# Altium schematic sheet BlockDiagram.SchDoc
size A3; ApprovedBy: -; CheckedBy: -; Engineer: Nasıf Can PELTEK; Revision: 00; SheetNumber: 2; SheetTotal: 7; releaseDate: -; changeDate: -; Department: Embedded; Size: A3; projeDescription: Wirless Security Dedector; fileName: BlockDiagram.SchDoc
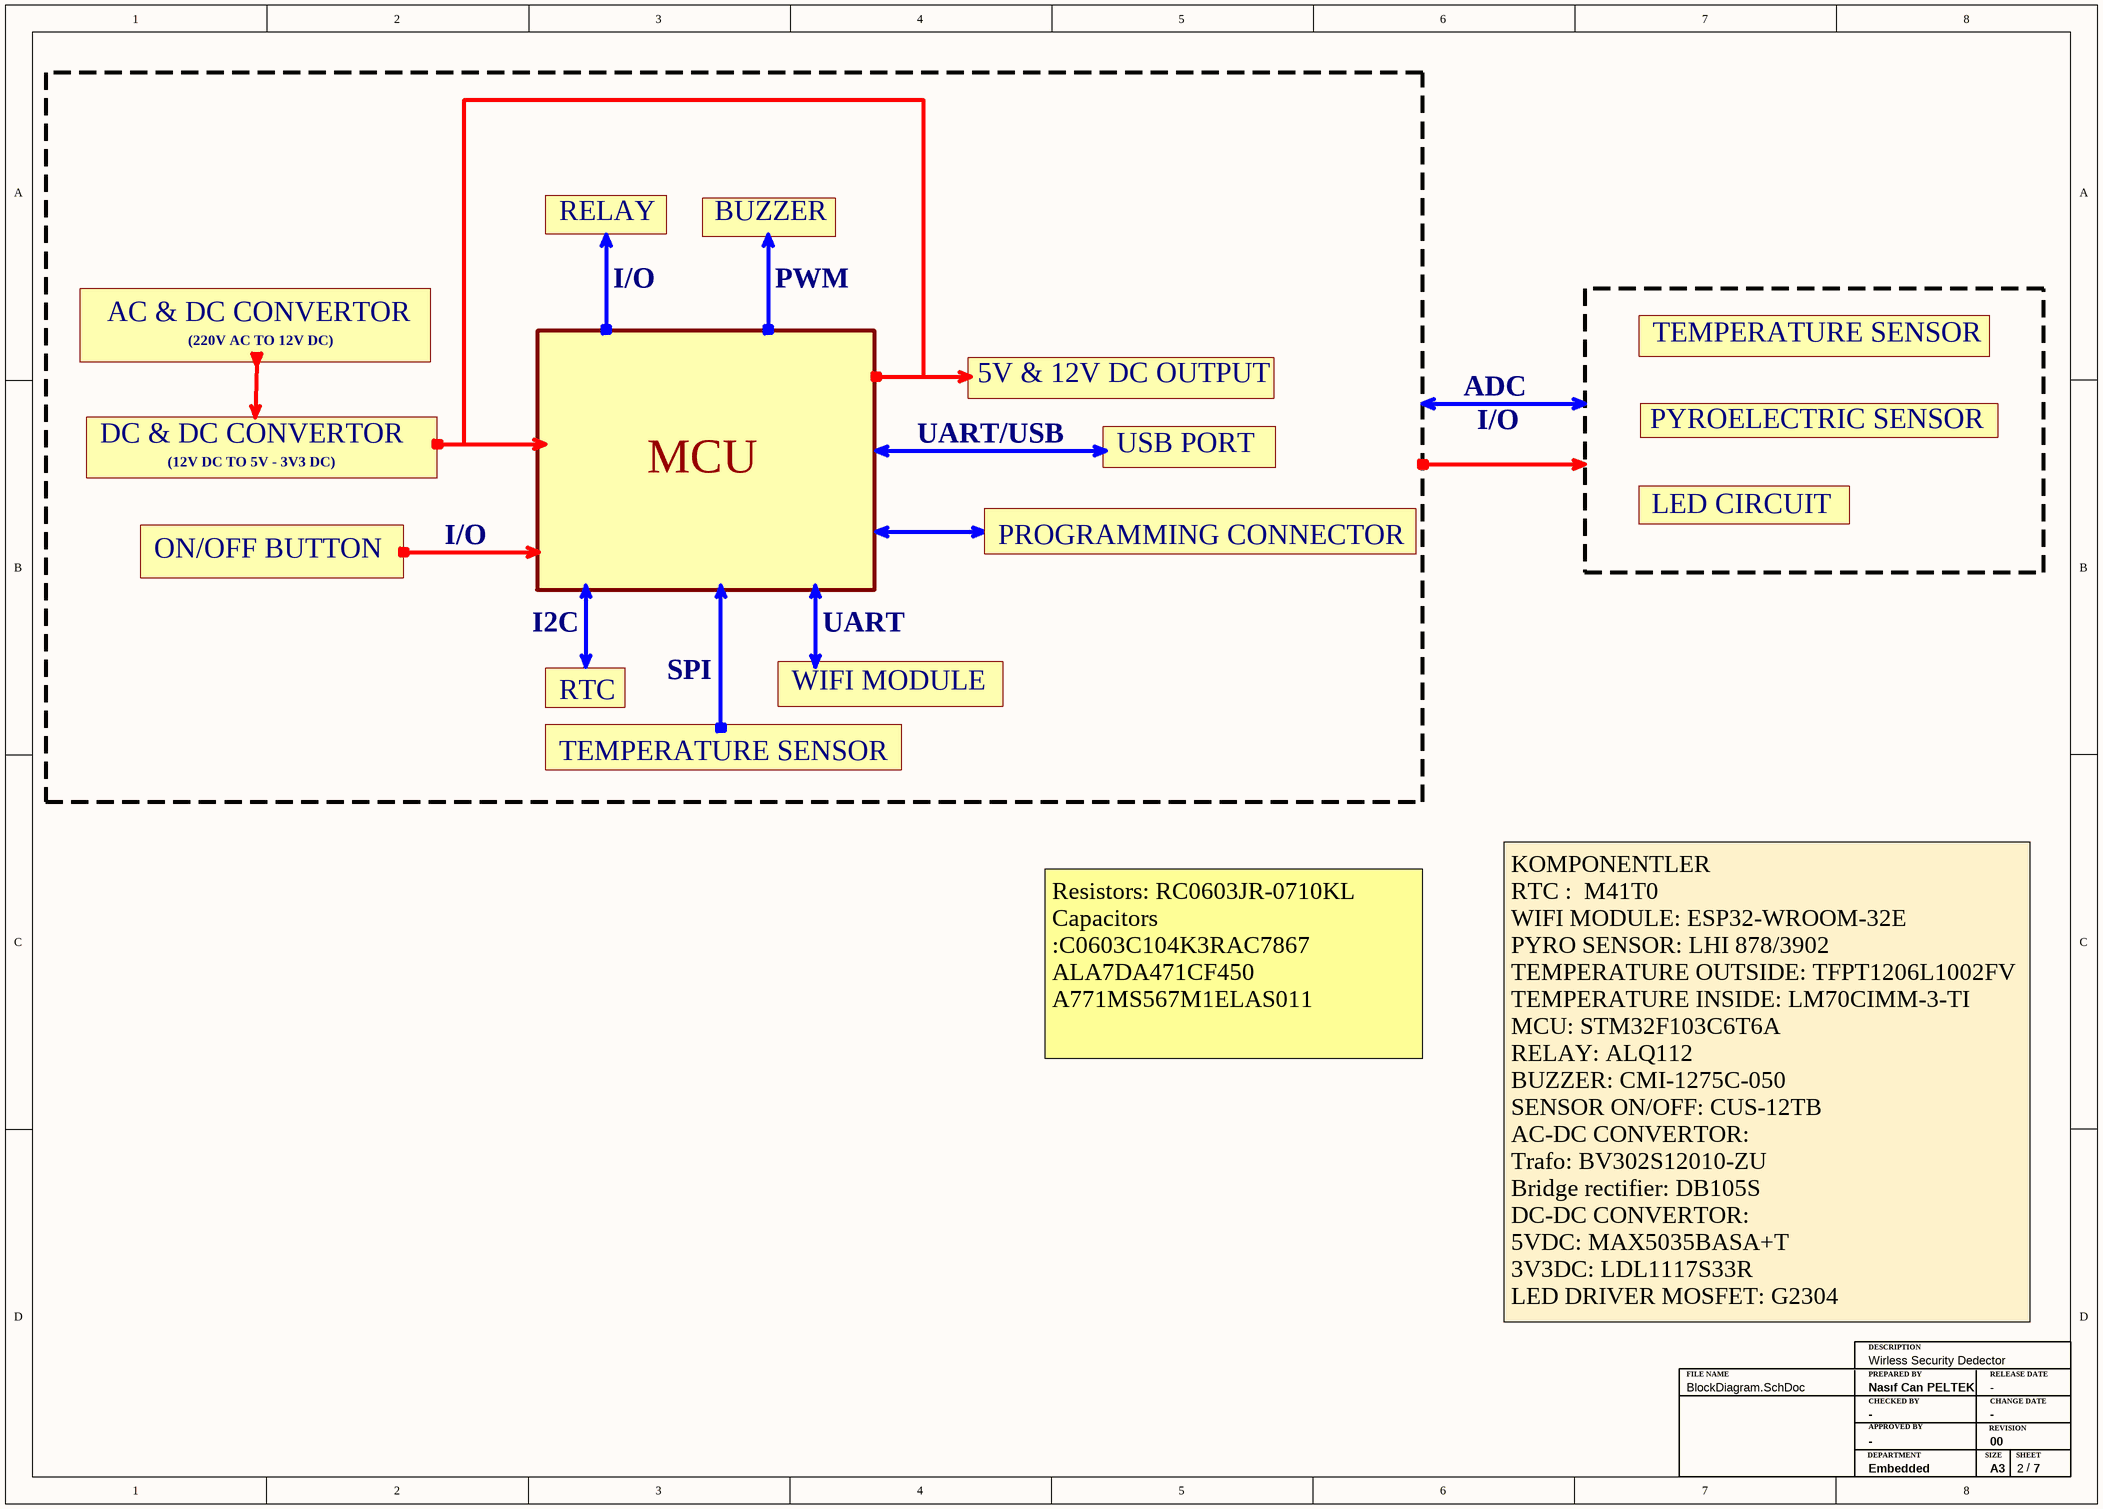
[diagram p0: BlockDiagram.SchDoc]

## Notes on the sheet
- RELAY
- BUZZER
- I/O
- PWM
- AC & DC CONVERTOR
- (220V AC TO 12V DC)
- TEMPERATURE SENSOR
- DC & DC CONVERTOR
- UART/USB
- 5V & 12V DC OUTPUT
- ADC
- PYROELECTRIC SENSOR
- (12V DC TO 5V - 3V3 DC)
- MCU
- USB PORT
- LED CIRCUIT
- ON/OFF BUTTON
- PROGRAMMING CONNECTOR
- I2C
- UART
- RTC
- SPI
- WIFI MODULE
- KOMPONENT TEDARIKCILERI
  Digi-Key
  Mouser
  Farnell
  RS Component
  LCSC
- Resistors: RC0603JR-0710KL
  Capacitors :C0603C104K3RAC7867
  ALA7DA471CF450
  A771MS567M1ELAS011
- KOMPONENTLER
  RTC :  M41T0
  WIFI MODULE: ESP32-WROOM-32E
  PYRO SENSOR: LHI 878/3902
  TEMPERATURE OUTSIDE: TFPT1206L1002FV
  TEMPERATURE INSIDE: LM70CIMM-3-TI
  MCU: STM32F103C6T6A
  RELAY: ALQ112
  BUZZER: CMI-1275C-050
  SENSOR ON/OFF: CUS-12TB
  AC-DC CONVERTOR:
  Trafo: BV302S12010-ZU
  Bridge rectifier: DB105S
  DC-DC CONVERTOR:
  5VDC: MAX5035BASA+T
  3V3DC: LDL1117S33R
  LED DRIVER MOSFET: G2304
- FILE NAME
- PREPARED BY
- DESCRIPTION
- RELEASE DATE
- DEPARTMENT
- CHECKED BY
- APPROVED BY
- SIZE
- REVISION
- CHANGE DATE
- SHEET
- /